# Altium schematic sheet Score V4.SchDoc (part 2 of 2)
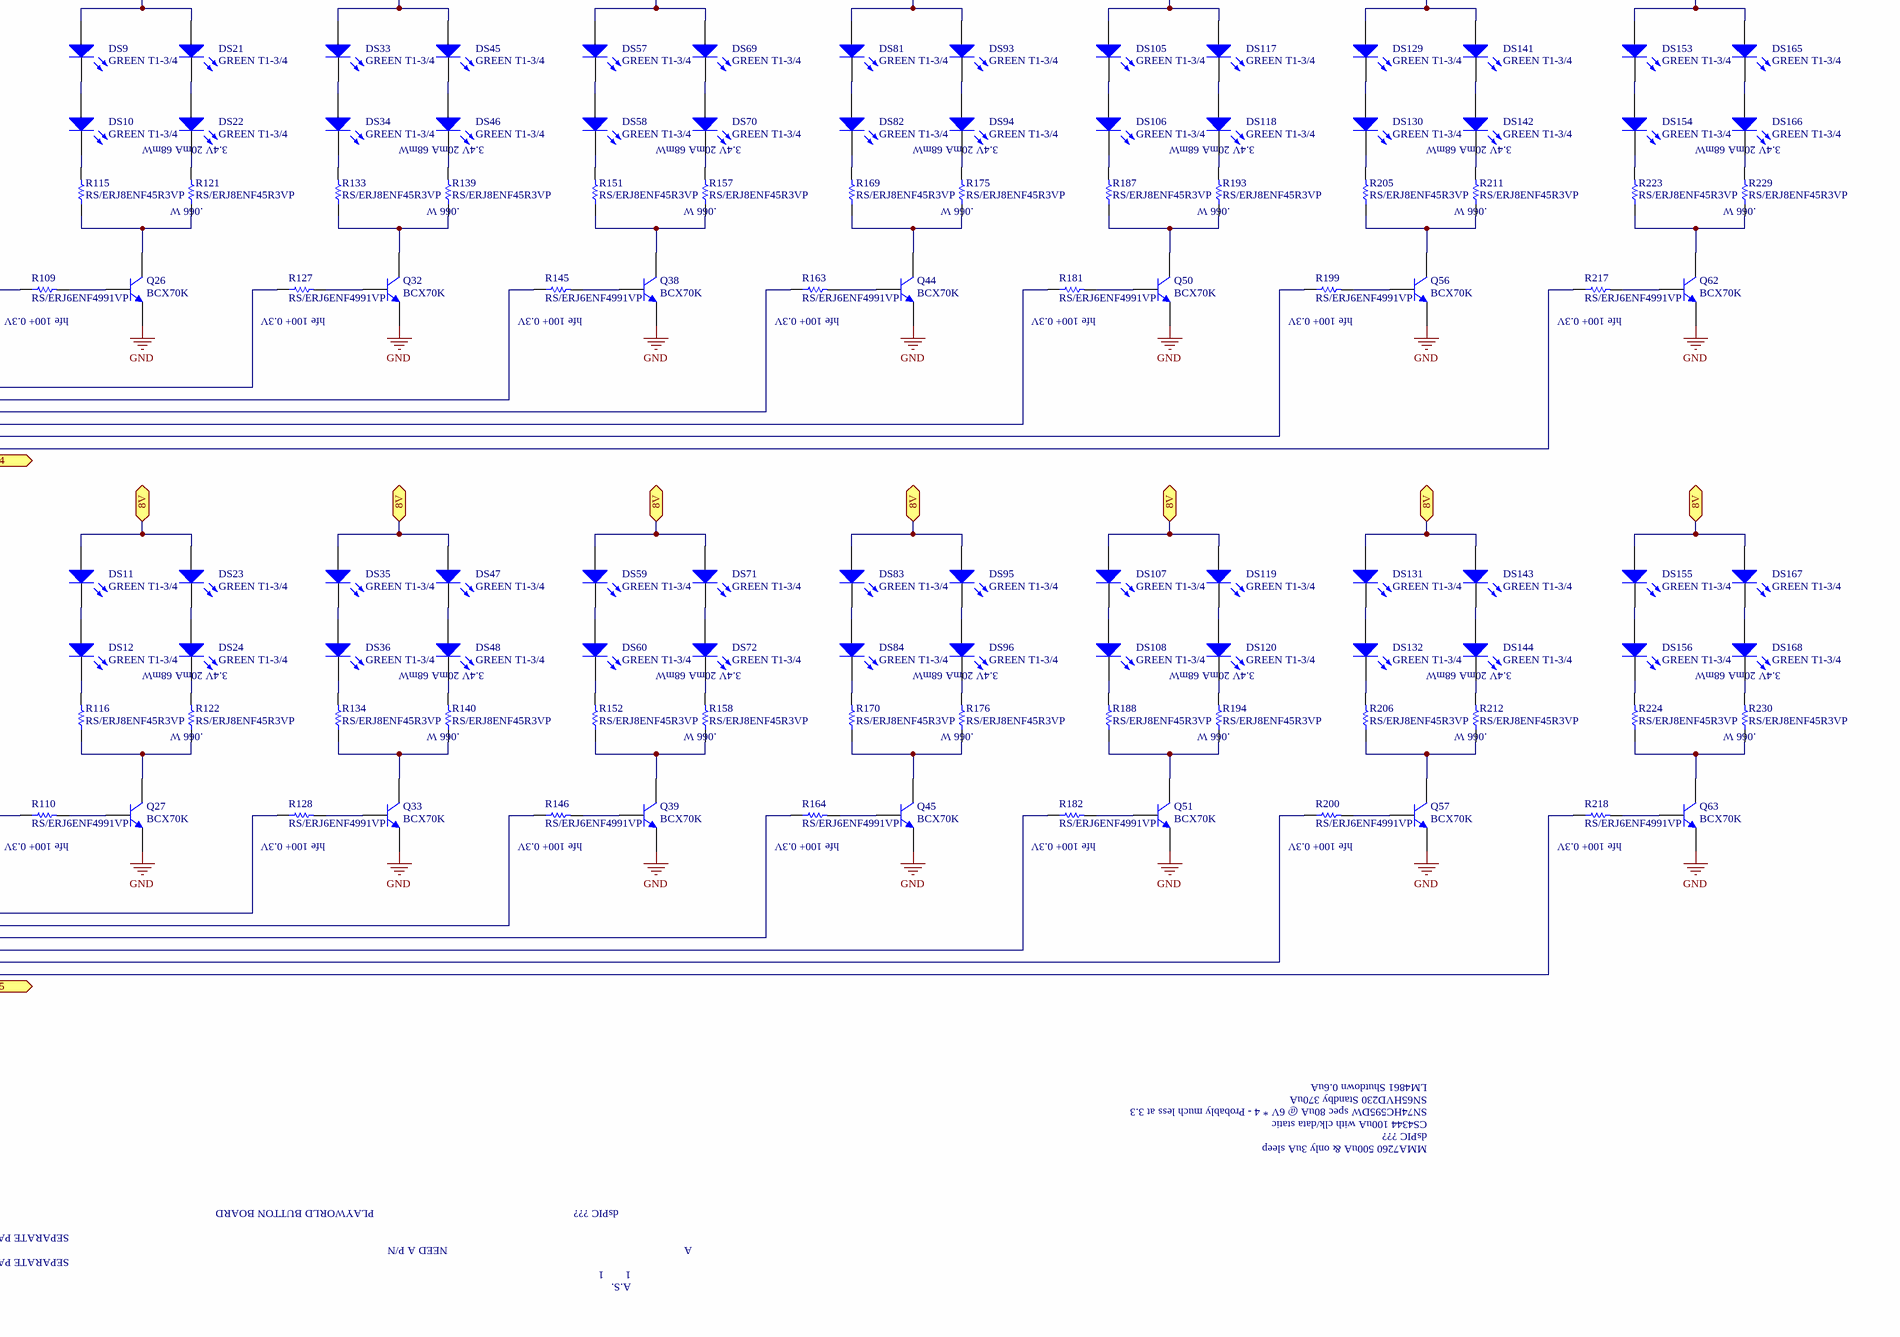
[diagram p9: Score V4.SchDoc, bottom right]

## Library data of the parts
C1 C3-C6 C10 C11 C14 C16 C17 C25 C28-C31 C33-C40 C43 C46-C54 = CS/C0805C104K5RACK: Kemet .1uF 0805; Published: 23-Sep-2002; Publisher: Altium Limited
C2 C7 C12 C18 C23 C32 C41 C42 C44 C45 = CS/EEVFK1C100RP: Panasonic 10uF 16V SMT; Published: 8-Jun-2000; LatestRevisionDate: 17-Jul-2002; LatestRevisionNote: Re-released for DXP Platform.; PackageReference: C0805; Publisher: Altium Limited
C8 C9 = C#S/T491X476K035ATK: Kemet Tantalum 47uF 35V EIA7343-43; PCB_Layout: Round Glue Pad at 2.9 ±0.1mm in diameter at KEMET's option; Published: 17-Jul-2002; LatestRevisionDate: 19-Mar-2004; LatestRevisionNote: Silkscreen dimensions re-sized.; PackageReference: X; Publisher: Altium Limited; DatasheetDocument: Mar-2001; PackageDocument: Mar-2001; Code_JEITA: 7343-43; ComponentLink1Description: Manufacturer Link; ComponentLink1URL: http://www.kemet.com/; ComponentLink2Description: Datasheet; ComponentLink2URL: http://www.kemet.com/kemet/web/homepage/kechome.nsf/vapubfilesname/F3102TA.pdf/$file/F3102TA.pdf
C13 C19 C27 = CS/ECJ3YB1E105KP: 1uF 25V 1206 Panasonic; Published: 23-Sep-2002; Publisher: Altium Limited
C15 = CS/C0805C103K5RAC: Kemet .01uF 0805; Published: 23-Sep-2002; Publisher: Altium Limited
C20 C24 = CS/T495D686K016ASE1K: Solid Tantalum Chip Capacitor, Standard T495 Series - D Size; Published: 17-Jul-2002; LatestRevisionDate: 19-Mar-2004; LatestRevisionNote: Silkscreen dimensions re-sized.; DatasheetDocument: Mar-2001; PackageDocument: Mar-2001; PackageReference: D; Publisher: Altium Limited; Code_JEITA: 7343-31; ComponentLink1Description: Manufacturer Link; ComponentLink1URL: http://www.kemet.com/; ComponentLink2Description: Datasheet; ComponentLink2URL: http://www.kemet.com/kemet/web/homepage/kechome.nsf/vapubfilesname/F3102TA.pdf/$file/F3102TA.pdf
C21 = CS/ECJ3VB1E334KP: .33uF 25V 1206 Panasonic; Published: 23-Sep-2002; Publisher: Altium Limited
C22 C26 = CS/C0805C180J5GACTUK: Kemet 18pF 50V 0805; Published: 23-Sep-2002; Publisher: Altium Limited
D1 = D#S/MURS360T3GM: Diode 3A 600V SMC; Note: Pin 2 is not connected and not drawn.; Published: 21-Mar-2003; PackageReference: SOT-23; Publisher: Altium Limited; ComponentLink1Description: Manufacturer Link; ComponentLink1URL: http://www.infineon.com/; DatasheetDocument: Oct-1999; PackageDocument: Sep-2001
D2 = DS/8TQ080S0Z: IR Schottky Diode 8A 80V D2PAK; Published: 8-Jun-2000; LatestRevisionDate: 17-Jul-2002; LatestRevisionNote: Re-released for DXP Platform.; PackageReference: SMB; Publisher: Altium Limited; Code_JEDEC: DO-214-AA
D3-D11 D15-D25 = DS/MMSZ5225BT1Z: Zener 3.0V SOD-123; Published: 8-Jun-2000; LatestRevisionDate: 17-Jul-2002; LatestRevisionNote: Re-released for DXP Platform.; DatasheetDocument: REV. L-2; PackageReference: SOD-123; Publisher: Altium Limited; ComponentLink1Description: Manufacturer Link; ComponentLink1URL: http://www.vishay.com/
D12-D14 = DS/BAS16000Z: Zetex BAS16 Diode; Note: Pin 2 is not connected and not drawn.; Published: 21-Mar-2003; DatasheetDocument: Oct-1999; PackageDocument: Sep-2001; PackageReference: SOT-23; Publisher: Altium Limited; ComponentLink1Description: Manufacturer Link; ComponentLink1URL: http://www.infineon.com/
DS1-DS6 DS13-DS18 DS25-DS30 DS37-DS42 DS49-DS54 DS61-DS66 DS73-DS78 DS85-DS90 DS97-DS102 DS109-DS114 DS121-DS126 DS133-DS138 DS145-DS150 DS157-DS162 = LRCOVLFR3C7Z: Optek LED Red /Clear High Brightness T1-3/4; Published: 8-Jun-2000; LatestRevisionDate: 08-Jul-2005; LatestRevisionNote: Mech Layer 1 removed.; PackageReference: LED-1; Publisher: Altium Limited
DS7-DS12 DS19-DS24 DS31-DS36 DS43-DS48 DS55-DS60 DS67-DS72 DS79-DS84 DS91-DS96 DS103-DS108 DS115-DS120 DS127-DS132 DS139-DS144 DS151-DS156 DS163-DS168 = LGCOVLFG3C7Z: Optek LED Green/Clear High Brightness T1-3/4; Published: 8-Jun-2000; LatestRevisionDate: 08-Jul-2005; LatestRevisionNote: Mech Layer 1 removed.; PackageReference: LED-1; Publisher: Altium Limited
J11 J12 J16 J17 = JDT1512PA00Z: Deutsch 12P Sealed PCB connector; LatestRevisionDate: 17-Jul-2002; LatestRevisionNote: Re-released for DXP Platform.; Publisher: Altium Limited
J13 = JCPM5086VE0Z: ASI Vert Term Strip Header 3 Pos 5.08mm; LatestRevisionDate: 17-Jul-2002; LatestRevisionNote: Re-released for DXP Platform.; Publisher: Altium Limited
J14 = 787834-2: USB 1.1, Vertical, Thru-Hole, B Type, Receptacle, 4 Position, Natural; ContactMaterial: Copper Alloy; ContactPlating: Gold Flash over Palladium Nickel or Gold (30) over Nickel; TerminationLength: 3.02mm [0.119in.]; PCB_Layout: Complies with manufacturer's recommendation.; DrillSize: Corresponds to nominal value.; PanelGround: Without; Published: 15-Jul-2004; DatasheetDocument: 11-Jan-2004; PackageDocument: 11-Jan-2004; PackageReference: 787834; Publisher: Altium Limited; HousingMaterial: Thermoplastic; ComponentLink1Description: Manufacturer Link; ComponentLink1URL: http://www.tycoelectronics.com/; ComponentLink2Description: Packaging Specification; ComponentLink2URL: http://ecommas.tycoelectronics.com/commerce/DocumentDelivery/DDEController?Action=showdoc&DocId=Customer+Drawing%7F787834%7FG%7Ftif%7FEnglish%7FC_787834_G.tif
J15 = JK85ED9SBR0Z: D-Sub 9S Kycon Straight W/retainers; PackageDocument: O; Positions: 9; Gender: Receptacle; Published: 15-Jun-2001; LatestRevisionDate: 17-Jul-2002; LatestRevisionNote: Re-released for DXP Platform.; DatasheetDocument: 1-Sep-1999; PackageReference: 788750; Publisher: Altium Limited; Orientation: Right Angle
J18 = JTSW12011TSRAM: Samtec Header RA 20P Stood off board; LatestRevisionDate: 17-Jul-2002; LatestRevisionNote: Re-released for DXP Platform.; Publisher: Altium Limited
J19 = JDT1506PA00Z: Deutsch 6P Sealed PCB connector; LatestRevisionDate: 17-Jul-2002; LatestRevisionNote: Re-released for DXP Platform.; Publisher: Altium Limited
JP1-JP4 R1-R4 R6-R18 R20-R31 R33-R66 R68-R74 R76-R110 R123-R128 R141-R146 R159-R164 R177-R182 R195-R200 R213-R218 R231-R234 = RS/ERJ6ENF: Panasonic Precision Thick Film Chip Resistor, 10 Ohm to 2.2M Ohm Range, 1% Tolerance, 0805 Size, 0.1 W; Value: 121; Published: 17-Dec-2003; LatestRevisionDate: 19-Mar-2004; LatestRevisionNote: Silkscreen size reduced.; PackageDocument: Mar-2003; PackageReference: 6-0805; Publisher: Altium Limited; ComponentLink1Description: Manufacturer Link; ComponentLink1URL: http://www.panasonic.com/flash.html; Code_IPC: 2012 [0805]
L1 = NS/DO5022P333Z: Magnetic-Core Inductor; Value: 33mH; Published: 24-Mar-1999; LatestRevisionDate: 17-Jul-2002; LatestRevisionNote: Re-released for DXP Platform.; Publisher: Altium Limited
M1-M6 = MountingHole_1/4
Q1-Q21 = QS/VNB14NV04Z: HEXFET Power MOSFET; Published: 8-Jun-2000; LatestRevisionDate: 17-Jul-2002; LatestRevisionNote: Re-released for DXP Platform.; DatasheetDocument: May-1998; PackageReference: D2PAK; Publisher: Altium Limited; ComponentLink1Description: Manufacturer Link; ComponentLink1URL: http://www.irf.com/; ComponentLink2Description: Datasheet; ComponentLink2URL: http://www.irf.com/product-info/datasheets/data/irf540ns.pdf
Q22-Q63 = QS/BCX70K00Z: NPN SOT23 Silicon Planar Small Signal Transistor; PackageDocument: 1996; Published: 8-Jun-2000; LatestRevisionDate: 17-Jul-2002; LatestRevisionNote: Re-released for DXP Platform.; DatasheetDocument: Feb-1995; PackageReference: SOT23; Publisher: Altium Limited; ComponentLink1Description: Manufacturer Link; ComponentLink1URL: http://www.zetex.com/; ComponentLink2Description: Datasheet; ComponentLink2URL: www.zetex.com/3.0/pdf/BCX70.pdf
R5 R111-R113 R117-R122 R129-R131 R135-R140 R147-R149 R153-R158 R165-R167 R171-R176 R183-R185 R189-R194 R201-R203 R207-R212 R219-R221 R225-R230 = RS/ERJ8ENF: Panasonic resistor MF 1% SMT; Value: 121; Published: 17-Dec-2003; LatestRevisionDate: 19-Mar-2004; LatestRevisionNote: Silkscreen size reduced.; PackageDocument: Mar-2003; PackageReference: 6-0805; Publisher: Altium Limited; ComponentLink1Description: Manufacturer Link; ComponentLink1URL: http://www.panasonic.com/flash.html; Code_IPC: 2012 [0805]
R19 R32 = RS/ERJ6GEYJ: Panasonic Precision Thick Film Chip Resistor, 10 Ohm to 2.2M Ohm Range, 5% Tolerance, 0805 Size, 0.1 W; Value: 121; Published: 17-Dec-2003; LatestRevisionDate: 19-Mar-2004; LatestRevisionNote: Silkscreen size reduced.; PackageDocument: Mar-2003; PackageReference: 6-0805; Publisher: Altium Limited; ComponentLink1Description: Manufacturer Link; ComponentLink1URL: http://www.panasonic.com/flash.html; Code_IPC: 2012 [0805]
R67 = RES 5W: Resistor 5W square ceramic; Published: 8-Jun-2000; LatestRevisionDate: 17-Jul-2002; LatestRevisionNote: Re-released for DXP Platform.; Publisher: Altium Limited
R75 = P3299W11030B: Bourns Trim Pot 10K Vertical; Published: 8-Jun-2000; LatestRevisionDate: 17-Jul-2002; LatestRevisionNote: Re-released for DXP Platform.; PackageReference: AXIAL-0.3; Publisher: Altium Limited
R114-R116 R132-R134 R150-R152 R168-R170 R186-R188 R204-R206 R222-R224 = RS/ERJ8ENF: Panasonic resistor MF 1% SMT; Value: 45.3; Published: 17-Dec-2003; LatestRevisionDate: 19-Mar-2004; LatestRevisionNote: Silkscreen size reduced.; PackageDocument: Mar-2003; PackageReference: 6-0805; Publisher: Altium Limited; ComponentLink1Description: Manufacturer Link; ComponentLink1URL: http://www.panasonic.com/flash.html; Code_IPC: 2012 [0805]
U1 U14 U19-U24 = IS/SN74HC573DWZ: Octal D-Type Transparent Latch with 3-State Outputs; Published: 8-Jun-2000; LatestRevisionDate: 04-Mar-2005; LatestRevisionNote: Stylized 3D Model Added.; DatasheetDocument: Jun-1989; PackageDocument: Mar-2000; PackageReference: DW020; Publisher: Altium Limited; Code_JEDEC: MS-013; ComponentLink1Description: Manufacturer Link; ComponentLink1URL: http://www.ti.com/
U2 U6 U9 U13 = IS/M25P64VMF6GZ: ST Serial memory 64MBit SOIC-16
U3 = I#S/DSPIC30F6014A30IPTZ: Microchip dsPIC30F6014A 80-TQFP; Published: 11-Oct-2004; Publisher: Altium Limited; ComponentLink1Description: Manufacturer Link; ComponentLink1URL: http://www.microchip.com/index.asp; ComponentLink3Description: Packaging Specification
U4 = IS/CS4344CZZZ: Cirrus 24 bit DAC
U5 = IS/SN65HVD230DRT: CAN Transceiver 3.3V w/standby; Published: 15-May-2002; LatestRevisionDate: 04-Mar-2005; LatestRevisionNote: Stylized 3D Model Added.; DatasheetDocument: Sep-1989; PackageDocument: Jan-1998; PackageReference: D008; Publisher: Altium Limited; ComponentLink1Description: Manufacturer Link; ComponentLink1URL: http://www.ti.com/; ComponentLink2Description: Datasheet
U7 = IS/LM2676SADJN: Simple Switcher Power Converter 150 kHz 3A Step Down Voltage Regulator; Note: Tab is connected to GND; Published: 15-Apr-2002; DatasheetDocument: Dec-1997; PackageReference: TS5B; Publisher: Altium Limited; ComponentLink1Description: Manufacturer Link; ComponentLink1URL: http://www.national.com/; ComponentLink2Description: Datasheet; ComponentLink2URL: http://www.national.com/ds.cgi/LM/LM2596.pdf; ComponentLink3Description: URL Link1; ComponentLink3URL: http://www.national.com/pf/LM/LM2596.html
U8 U12 = IS/LP2950CDT33N: National Voltage reculator 3.3V DPAK; PackageDocument: 2000; Published: 15-Apr-2002; DatasheetDocument: May-1999; PackageReference: Z03A; Publisher: Altium Limited; ComponentLink1Description: Manufacturer Link; ComponentLink1URL: http://www.national.com/; ComponentLink2Description: Datasheet; ComponentLink2URL: http://www.national.com/ds.cgi/LP/LP2950.pdf; ComponentLink3Description: URL Link1; ComponentLink3URL: http://www.national.com/pf/LP/LP2950.html
U10 U18 = IS/SN74HC541DWZ: Octal Buffer and Line Driver with 3-State Outputs; Published: 8-Jun-2000; LatestRevisionDate: 13-Apr-2006; LatestRevisionNote: IPC-7351 Footprint Added.; DatasheetVersion: May-1997; PackageVersion: Mar-2000; PackageReference: DW020; Publisher: Altium Limited; PackageDescription: 20-Pin Plastic Small Outline Integrated Circuit 1.27 mm Pitch; Code_JEDEC: MS-013; Code_IPC: SOIC127P1030-20; ComponentLink1Description: Manufacturer Link; ComponentLink1URL: http://www.ti.com/; ComponentLink2Description: Datasheet; ComponentLink2URL: http://www-s.ti.com/sc/ds/sn74hct541.pdf
U11 = LM4861M: 1.1 Audio Power Amplifier with Shutdown Mode; Published: 15-Apr-2002; LatestRevisionDate: 06-Jun-2005; LatestRevisionNote: Stylized 3D Model Added.; DatasheetDocument: May-1997; PackageDocument: Sep-1997; PackageReference: M08A; Publisher: Altium Limited; Code_JEDEC: MS-012-AA; Code_IPC: SO8; ComponentLink1Description: Manufacturer Link; ComponentLink1URL: http://www.national.com/; ComponentLink2Description: Datasheet; ComponentLink2URL: http://www.national.com/ds.cgi/LM/LM4861.pdf; ComponentLink3Description: URL Link1; ComponentLink3URL: http://www.national.com/pf/LM/LM4861.html
U15 = IS/MAX3221IDBRT: TI 3.3V RS-232 chip 16-SSOP; PackageDocument: 1996; Published: 16-Jan-2001; LatestRevisionDate: 6-Jun-2005; LatestRevisionNote: Stylized 3D Model Added.; DatasheetDocument: Jan-1998; PackageReference: SSOP16; Publisher: Altium Limited; ComponentLink1Description: Manufacturer Link; ComponentLink1URL: http://www.maxim-ic.com/; ComponentLink2Description: Datasheet; ComponentLink2URL: http://pdfserv.maxim-ic.com/en/ds/MAX3221E-MAX3243E.pdf
U16 = IS/CP2102GMZ: Silicon Labs USB to UART bridge QFN-28
U17 = IS/ICL7660ACBA: Switched Capacitor Voltage Converter; Published: 15-Apr-2002; LatestRevisionDate: 06-Jun-2005; LatestRevisionNote: Stylized 3D Model Added.; DatasheetDocument: Apr-1997; PackageDocument: Sep-1997; PackageReference: M08A; Publisher: Altium Limited; Code_JEDEC: MS-012-AA; Code_IPC: SO8; ComponentLink1Description: Manufacturer Link; ComponentLink1URL: http://www.national.com/; ComponentLink2Description: Datasheet; ComponentLink2URL: http://www.national.com/ds.cgi/LM/LMC7660.pdf; ComponentLink3Description: URL Link1; ComponentLink3URL: http://www.national.com/pf/LM/LMC7660.html
U25 = IS/SN74HC138DZ: 3-Line to 8-Line Decoder / Demultiplexer; Published: 8-Jun-2000; LatestRevisionDate: 04-Mar-2005; LatestRevisionNote: Stylized 3D Model Added.; DatasheetDocument: May-1997; PackageDocument: Jan-1998; PackageReference: D016; Publisher: Altium Limited; ComponentLink1Description: Manufacturer Link; ComponentLink1URL: http://www.ti.com/; ComponentLink2Description: Datasheet; ComponentLink2URL: http://www-s.ti.com/sc/ds/sn74hc138.pdf
U26 = I#S/DS1306EN+Z: Serial Alarm Real-Time Clock; PackageDocument: 1999; Published: 13-Oct-2000; LatestRevisionDate: 06-Jun-2005; LatestRevisionNote: Stylized 3D Model Added.; DatasheetDocument: 20-Aug-1999; PackageReference: DIP16; Publisher: Altium Limited; ComponentLink1Description: Manufacturer Link; ComponentLink1URL: http://www.maxim-ic.com/; ComponentLink2Description: Datasheet; ComponentLink2URL: http://pdfserv.maxim-ic.com/en/ds/DS1306.pdf; ComponentLink3Description: Discontinuation Notice; ComponentLink3URL: http://www.maxim-ic.com/qa/pdfs/non-obsolescence-letter.pdf
Y1 = ZS/ECS1228205PTRZ: ECS Crystal 12.288MHz SMT CSM-7; Published: 17-Jul-2002; DatasheetDocument: 18-Apr-2000; PackageReference: CSM-7; Publisher: Altium Limited; ComponentLink1Description: Manufacturer Link; ComponentLink1URL: http://www.ecsxtal.com/; ComponentLink2Description: Datasheet; ComponentLink2URL: http://www.ecsxtal.com/pdf3/CSM_7.pdf
Y2 = ZS/MC30632.768KE3Z: Epson MC-306 32.768K-E3; Published: 17-Jul-2002; DatasheetDocument: 18-Apr-2000; PackageReference: ECX-3M; Publisher: Altium Limited; ComponentLink1Description: Manufacturer Link; ComponentLink1URL: http://www.ecsxtal.com/